# EAGLE design LoRaWio (EAGLE 6.3)
COMPANY: ADAFRUIT INDUSTRIES; DRAWN: KTOWN; REV: B
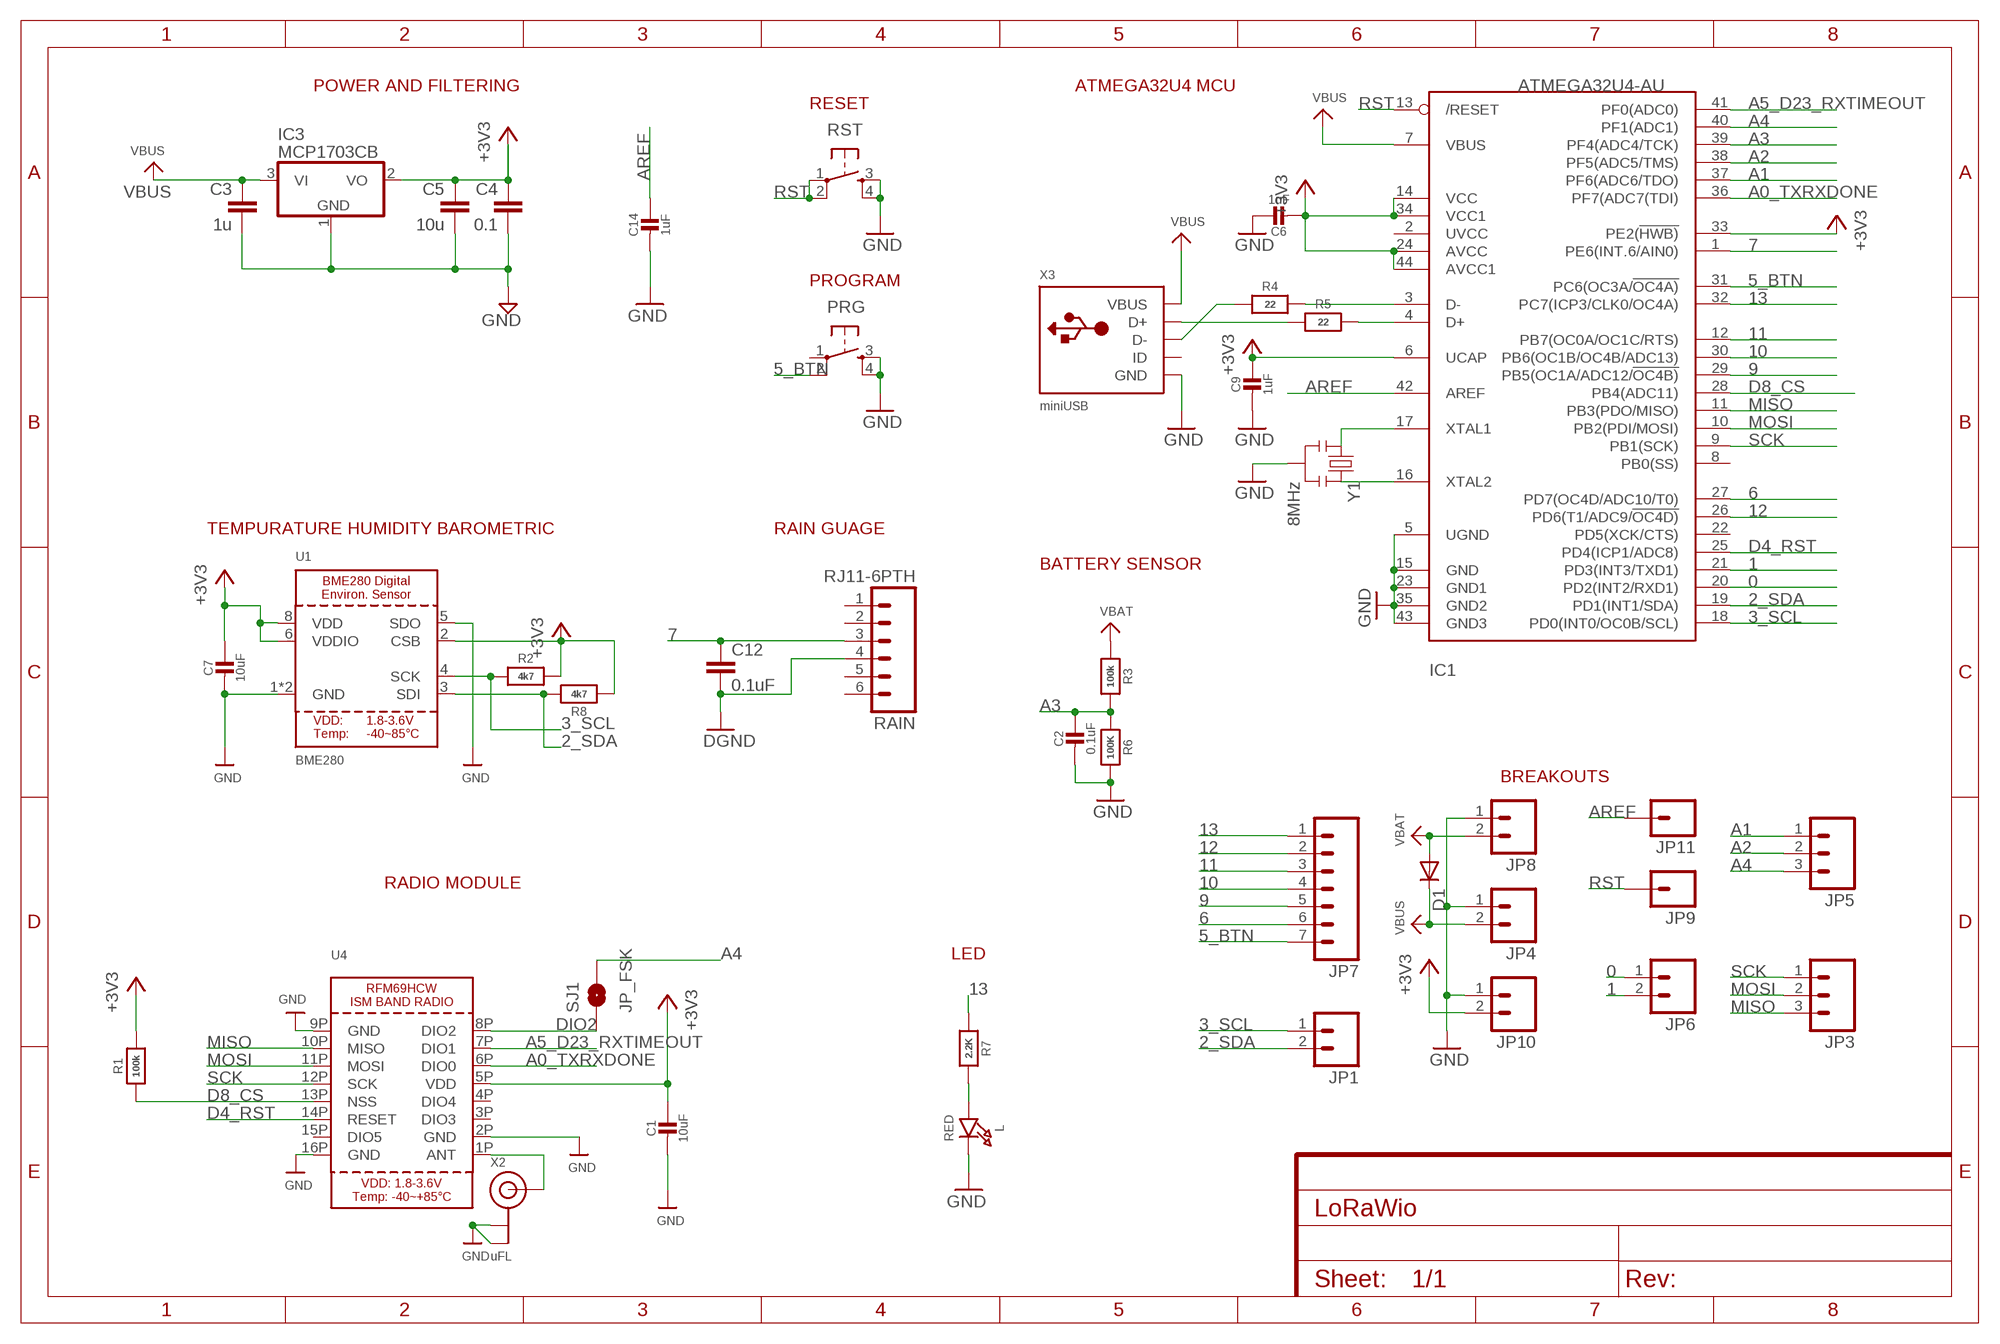
[diagram p0: schematic, sheet 1]

## Parts
C1  10uF  CAP_CERAMIC0805-NOOUTLINE  [0805-NO]
C2  0.1uF  CAP_CERAMIC0805-NOOUTLINE  [0805-NO]
C3  1u  CAP0805  [0805]
C4  0.1  CAP0805  [0805]
C5  10u  CAP0805-CAP  [0805-CAP]
C6  1uF  CAP_CERAMIC0805-NOOUTLINE  [0805-NO]
C7  10uF  CAP_CERAMIC0805-NOOUTLINE  [0805-NO]
C9  1uF  CAP_CERAMIC0805-NOOUTLINE  [0805-NO]
C12  0.1uF  CAP0805  [0805]
C14  1uF  CAP_CERAMIC0805-NOOUTLINE  [0805-NO]
D1  DIODESOD  [SOD-323]
IC1  ATMEGA32U4-AU  [TQFP44]
IC3  MCP1703CB  [SOT23]
JP1  M021X02_NO_SILK  [1X02_NO_SILK]
JP3  M031X03_NO_SILK  [1X03_NO_SILK]
JP4  M021X02_NO_SILK  [1X02_NO_SILK]
JP5  M031X03_NO_SILK  [1X03_NO_SILK]
JP6  M021X02_NO_SILK  [1X02_NO_SILK]
JP7  M07  [1X07]
JP8  M021X02_NO_SILK  [1X02_NO_SILK]
JP9  M01PTH_NO_SILK_YES_STOP  [1X01_NO_SILK]
JP10  M021X02_NO_SILK  [1X02_NO_SILK]
JP11  M01PTH_NO_SILK_YES_STOP  [1X01_NO_SILK]
L  RED  LED0805_NOOUTLINE  [CHIPLED_0805_NOOUTLINE]
PRG  TAC_SWITCHSMD  [TACTILE_SWITCH_SMD]
R1  100k  RESISTOR0805_NOOUTLINE  [0805-NO@1]
R2  4k7  RESISTOR0805_NOOUTLINE  [0805-NO@1]
R3  100k  RESISTOR0805_NOOUTLINE  [0805-NO@1]
R4  22  RESISTOR0805_NOOUTLINE  [0805-NO@1]
R5  22  RESISTOR0805_NOOUTLINE  [0805-NO@1]
R6  100K  RESISTOR0805_NOOUTLINE  [0805-NO@1]
R7  2.2K  RESISTOR0805_NOOUTLINE  [0805-NO@1]
R8  4k7  RESISTOR0805_NOOUTLINE  [0805-NO@1]
RAIN  RJ11-6PTH  [RJ11-6]
RST  TAC_SWITCHSMD  [TACTILE_SWITCH_SMD]
SJ1  JP_FSK  SPARKFUN-PASSIVES_SOLDERJUMPERNO  [SPARKFUN-PASSIVES_SJ_2S-NO]
U1  BME280  [BME280]
U4  RFM69HCW_SMT  [RFMHCW_SMT]
X2  uFL  ANTENNA_U.FL  [U.FL]
X3  miniUSB  USBMINIBLARGE  [USB-MINIB_LARGER]
Y1  8MHz  RESONATORSMD  [RESONATOR-SMD]

## Nets
0: IC1.20(PD2(INT2/RXD1)) JP6.1
1: IC1.21(PD3(INT3/TXD1)) JP6.2
2_SDA: IC1.19(PD1(INT1/SDA)) JP1.2 R8.2 U1.3(SDI)
3_SCL: IC1.18(PD0(INT0/OC0B/SCL)) JP1.1 R2.1 U1.4(SCK)
5_BTN: IC1.31(PC6(OC3A/!OC4A)) JP7.7 PRG.2
6: IC1.27(PD7(OC4D/ADC10/T0)) JP7.6
7: C12.1 IC1.1(PE6(INT.6/AIN0)) RAIN.3
9: IC1.29(PB5(OC1A/ADC12/!OC4B)) JP7.5
10: IC1.30(PB6(OC1B/OC4B/ADC13)) JP7.4
11: IC1.12(PB7(OC0A/OC1C/RTS)) JP7.3
12: IC1.26(PD6(T1/ADC9/!OC4D)) JP7.2
13: IC1.32(PC7(ICP3/CLK0/OC4A)) JP7.1 R7.1
+3V3: C1.1 C4.1 C5.1 C6.2 C7.1 C9.1 IC1.6(UCAP) IC1.14(VCC) IC1.24(AVCC) IC1.33(PE2(!HWB)) IC1.34(VCC1) IC1.44(AVCC1) IC3.2(VO) JP10.2 R1.2 R2.2 R8.1 U1.2(CSB) U1.6(VDDIO) U1.8(VDD) U4.5P(VDD)
A0_TXRXDONE: IC1.36(PF7(ADC7(TDI)) U4.6P(DIO0)
A1: IC1.37(PF6(ADC6/TDO)) JP5.1
A2: IC1.38(PF5(ADC5/TMS)) JP5.2
A3: C2.1 IC1.39(PF4(ADC4/TCK)) R3.2 R6.1
A4: IC1.40(PF1(ADC1)) JP5.3 SJ1.2
A5_D23_RXTIMEOUT: IC1.41(PF0(ADC0)) U4.7P(DIO1)
ANT: U4.1P(ANT) X2.3(SIGNAL)
AREF: C14.1 IC1.42(AREF) JP11.1
D4_RST: IC1.25(PD4(ICP1/ADC8)) U4.14P(RESET)
D8_CS: IC1.28(PB4(ADC11)) R1.1 U4.13P(NSS)
D+: IC1.4(D+) R5.2
D-: IC1.3(D-) R4.2
DIO2: SJ1.1 U4.8P(DIO2)
GND: C1.2 C2.2 C3.2 C4.2 C5.2 C6.1 C7.2 C9.2 C12.2 C14.2 IC1.5(UGND) IC1.15(GND) IC1.23(GND1) IC1.35(GND2) IC1.43(GND3) IC3.1(GND) JP4.1 JP8.1 JP10.1 L.C PRG.3 PRG.4 R6.2 RAIN.4 RST.3 RST.4 U1.1(GND) U1.5(SDO) U1.7(GND) U4.2P(GND) U4.9P(GND) U4.16P(GND) X2.1(GND) X2.2(GND) X3.GND X3.GND1(GND) X3.GND2(GND) X3.GND3(GND) X3.GND4(GND) Y1.2 ; supply symbol labelled DGND
MISO: IC1.11(PB3(PDO/MISO)) JP3.3 U4.10P(MISO)
MOSI: IC1.10(PB2(PDI/MOSI)) JP3.2 U4.11P(MOSI)
N$2: L.A R7.2
N$11: IC1.16(XTAL2) Y1.3
N$12: IC1.17(XTAL1) Y1.1
N$15: R5.1 X3.D+
N$16: R4.1 X3.D-
RST: IC1.13(/RESET) JP9.1 RST.1 RST.2
SCK: IC1.9(PB1(SCK)) JP3.1 U4.12P(SCK)
VBAT: D1.2(A) JP8.2 R3.1
VBUS: C3.1 D1.1(C) IC1.7(VBUS) IC3.3(VI) JP4.2 X3.VBUS
Unconnected: IC1.2(UVCC) IC1.8(PB0(SS)) IC1.22(PD5(XCK/CTS)) PRG.1 RAIN.1 RAIN.2 RAIN.5 RAIN.6 U4.3P(DIO3) U4.4P(DIO4) U4.15P(DIO5) X3.ID

## Notes on the sheet
- POWER AND FILTERING | ATMEGA32U4 MCU
- RESET
- PROGRAM
- TEMPURATURE HUMIDITY BAROMETRIC | RAIN GUAGE
- BATTERY SENSOR
- BREAKOUTS
- RADIO MODULE
- LED

## Library data of the parts
C1 C2 C6 C7 C9 C14 = microbuilder:CAP_CERAMIC: Ceramic Capacitors For new designs, use the packages preceded by an '_' character since they are more reliable: The following footprints should be used on most boards: _0402 - Standard footprint for regular board layouts _0603 - Standard footprint for regular board layouts _0805 - Standard footprint for regular board layouts _1206 - Standard footprint for regular board layouts For extremely tight-pitch boards where space is at a premium, the following 'micro-pitch' footprints can be used (smaller pads, no silkscreen outline, etc.): _0402MP - Micro-pitch footprint for very dense/compact boards _0603MP - Micro-pitch footprint for very dense/compact boards _0805MP - Micro-pitch footprint for very dense/compact boards _1206MP - Micro-pitch footprint for very dense/compact boards
C3-C5 = LowPowerLab:CAP: Capacitor Standard 0603 ceramic capacitor, and 0.1" leaded capacitor.
C12 = SparkFun-Capacitors:CAP: Capacitor Standard 0603 ceramic capacitor, and 0.1" leaded capacitor.
D1 = SparkFun-DiscreteSemi:DIODE: Diode These are standard reverse protection diodes and small signal diodes. SMA package can handle up to about 1A. SOD-323 can handle about 200mA. What the SOD-323 package when ordering, there are some mfgs out there that are 5-pin packages.
IC1 = microbuilder:ATMEGA32U4: http://www.ladyada.net/library/eagle
IC3 = linear:MCP1703: 250 mA, 16V, Low Quiescent Current LDO Regulator Source: http://ww1.microchip.com/downloads/en/DeviceDoc/22049b.pdf
JP1 JP4 JP6 JP8 JP10 = SparkFun-Connectors:M02: Standard 2-pin 0.1" header. Use with - straight break away headers ( PRT-00116) - right angle break away headers (PRT-00553) - swiss pins (PRT-00743) - machine pins (PRT-00117) - female headers (PRT-00115) Molex polarized connector foot print use with: PRT-08233 with associated crimp pins and housings. 2.54_SCREWTERM for use with PRT-10571. 3.5mm Screw Terminal footprints for PRT-08084 5mm Screw Terminal footprints for use with PRT-08432
JP3 JP5 = SparkFun-Connectors:M03: Header 3 Standard 3-pin 0.1" header. Use with straight break away headers (SKU : PRT-00116), right angle break away headers (PRT-00553), swiss pins (PRT-00743), machine pins (PRT-00117), and female headers (PRT-00115). Molex polarized connector foot print use with SKU : PRT-08232 with associated crimp pins and housings.
JP7 = SparkFun-Connectors:M07: Header 7 Standard 7-pin 0.1" header. Use with straight break away headers (SKU : PRT-00116), right angle break away headers (PRT-00553), swiss pins (PRT-00743), machine pins (PRT-00117), and female headers (PRT-00115). NOTES ON THE VARIANTS LOCK and LOCK_LONGPADS... This footprint was designed to help hold the alignment of a through-hole component (i.e. 7-pin header) while soldering it into place. You may notice that each hole has been shifted either up or down by 0.005 of an inch from it's more standard position (which is usually a perfectly straight line). This slight alteration caused the pins (the squares in the middle) to touch the edges of the holes. Because they are alternating, it causes a "brace" to hold the header in place. 0.005 has proven to be the perfect amount of "off-center" position when using our standard breakaway headers. Although looks a little odd when you look at the bare footprint, once you have a header in there, the alteration is very hard to notice. Also, if you push a header all the way into place, it is covered up entirely on the bottom side. This idea of altering the position of holes to aid alignment will be further integrated into the Sparkfun Library for other footprints. It can help hold any component with 3 or more connection pins.
JP9 JP11 = SparkFun-Connectors:M01: Header 1 Standard 1-pin 0.1" header. Use with straight break away headers (SKU : PRT-00116), right angle break away headers (PRT-00553), swiss pins (PRT-00743), machine pins (PRT-00117), and female headers (PRT-00115).
L = microbuilder:LED: LED 0603 - 0603 Surface Mount Package 2mA: Green LED - Low Power (3.9mcd, 2ma, 1.7Vf) - Digikey: 475-2709-2-ND Orange LED - Low Power (9.8mcd, 2ma, 1.8Vf) - Digikey: 475-1194-2-ND Red LED - Low Power (5mcd, 2ma, 1.8Vf) - Digikey: 475-1195-2-ND Yellow LED - Low Power (7mcd, 2ma, 1.8Vf) - Digikey: 475-1196-2-ND 5mA: Blue LED - Low Power (17mcd, 5ma, 2.9Vf) - Digikey: LNJ937W8CRACT-ND 0805 - 0805 Surface Mount Package 2mA: Red LED (8.8mcd, 2mA, 1.8Vf, Clear) - Low Power [Digikey: 475-2510-1-ND] Green LED (5mcd, 2mA, 1.8Vf, Clear) - Low Power [Digikey: 475-2730-1-ND] Yellow LED (11.3mcd, 2mA, 1.8Vf, Clear) - Low Power [Digikey: 475-2555-1-ND] 20mA: Red LED (104mcd, 20mA, Diffused) - LS R976 [Digikey: 475-1278-6-ND] Red LED (12mcd, 20mA, 2.0Vf, Clear) - APT2012EC [Digikey: 754-1128-1-ND] Green LED (15mcd, 20mA, 2.2Vf, Clear) - APT2012GC [Digikey: 754-1131-1-ND] Orange LED (160mcd, 20mA, 2.1Vf, Clear) - APT2012SECK [Digikey: 754-1130-1-ND] 1206 - 1206 Surface Mount Package Green LED (26mcd, 20mA, Diffused) - LG N971 [Digikey: 475-1407-6-ND] Red LED (15mcd, 20mA, Diffused) - LH N974 [Digikey: 475-1416-6-ND] Cree - Cree High-Power Surface Mount LEDs XPEBWT-L1-0000-00D50 - White 111lm 350mA 2.9Vf 6200K 110° XTEAWT-00-0000-00000LEE3 - White 114lm 350mA 2.85Vf 5000K 115° Everlight - Everlight 45-21 Series Surface Mount LEDs 45-21/QK2C-B2832AC2CB2/2T - Warm White 2000mcd 20mA 3.25Vf 3050K 120° 45-21/LK2C-B38452C4CB2/2T - Nuetral White 2000mcd 20mA 3.25Vf 4150K 120° 45-21/LK2C-B50634C6CB2/2T - Cold White 2200mcd 20mA 3.25Vf 5650K 120° PLCC2 Reverse Mount LS T77K-J1L2-1-0-2-R18-Z - Red 11.25mcd 2mA 1.8Vf 630nm 120° LO T77K-L1M2-24-Z - Orange 19.6mcd 2mA 1.8Vf 606nm 120° LY T77K-K2M1-26-Z - Yellow 15.7mcd 2mA 1.8Vf 587nm 120°
PRG RST = SparkFun-Electromechanical:TAC_SWITCH: Momentary Switch Button commonly used for reset or general input. Spark Fun Electronics SKU : COM-00097 SMT- SWCH-08247; PROD_ID: SWCH-08247
R1-R8 = microbuilder:RESISTOR: Resistors For new designs, use the packages preceded by an '_' character since they are more reliable: The following footprints should be used on most boards: _0402 - Standard footprint for regular board layouts _0603 - Standard footprint for regular board layouts _0805 - Standard footprint for regular board layouts _1206 - Standard footprint for regular board layouts For extremely tight-pitch boards where space is at a premium, the following 'micro-pitch' footprints can be used (smaller pads, no silkscreen outline, etc.): _0402MP - Micro-pitch footprint for very dense/compact boards _0603MP - Micro-pitch footprint for very dense/compact boards _0805MP - Micro-pitch footprint for very dense/compact boards _1206MP - Micro-pitch footprint for very dense/compact boards
RAIN = SparkFun-Connectors:RJ11-6: RJ11 Jack Simple 6 pin RJ11 jack. Commonly found on CAT3 devices and Microchip programmers. SKU: PRT-00132; PROD_ID: CONN-08590; VALUE: RJ11
SJ1 = tempLED_GARAGE_BOX:SPARKFUN-PASSIVES_SOLDERJUMPER: Solder Jumper Standard SMD solder jumper. Used to automate production. Two varients : Normally Open and Normally Closed are the same, but have different paste layers. NC will have a large amount of paste and should jumper during reflow.
U1 = microbuilder:BME280: BME280 - Environmental Sensor (I2C + SPI)
U4 = microbuilder:RFM69HCW: RFM69HCW - ISM Band RF Transceiver
X2 = microbuilder:ANTENNA_U.FL: U.FL Antenna Connector
X3 = microbuilder:USB: USB Connectors USBMINIB - Surface Mount Female Mini-B USB Connector 4UConnector: 06564
Y1 = SparkFun:RESONATOR: Resonator Small SMD resonator. This is the itty bitty 10/20MHz resonators with built in caps. CSTCE10M0G55 and CSTCE20M0V53. Footprint has been reviewed closely but hasn't been tested yet.

## Net classes
1 power: width 0.381 mm, clearance 0.254 mm

## Board
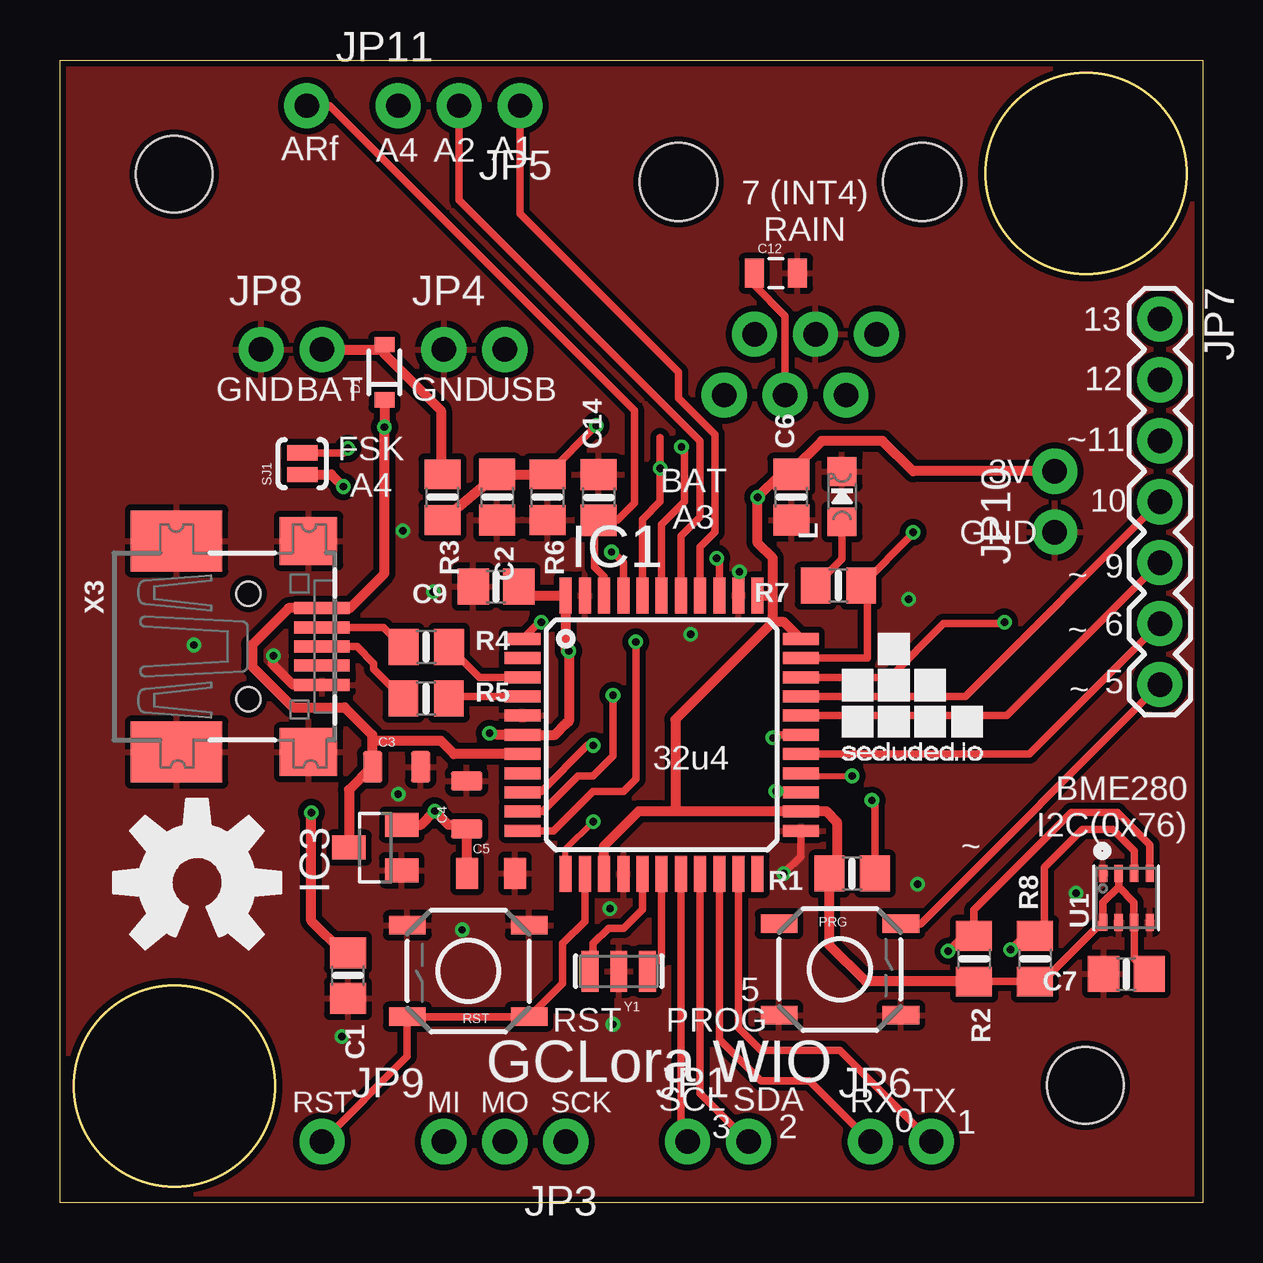
[diagram p1: board, top side]
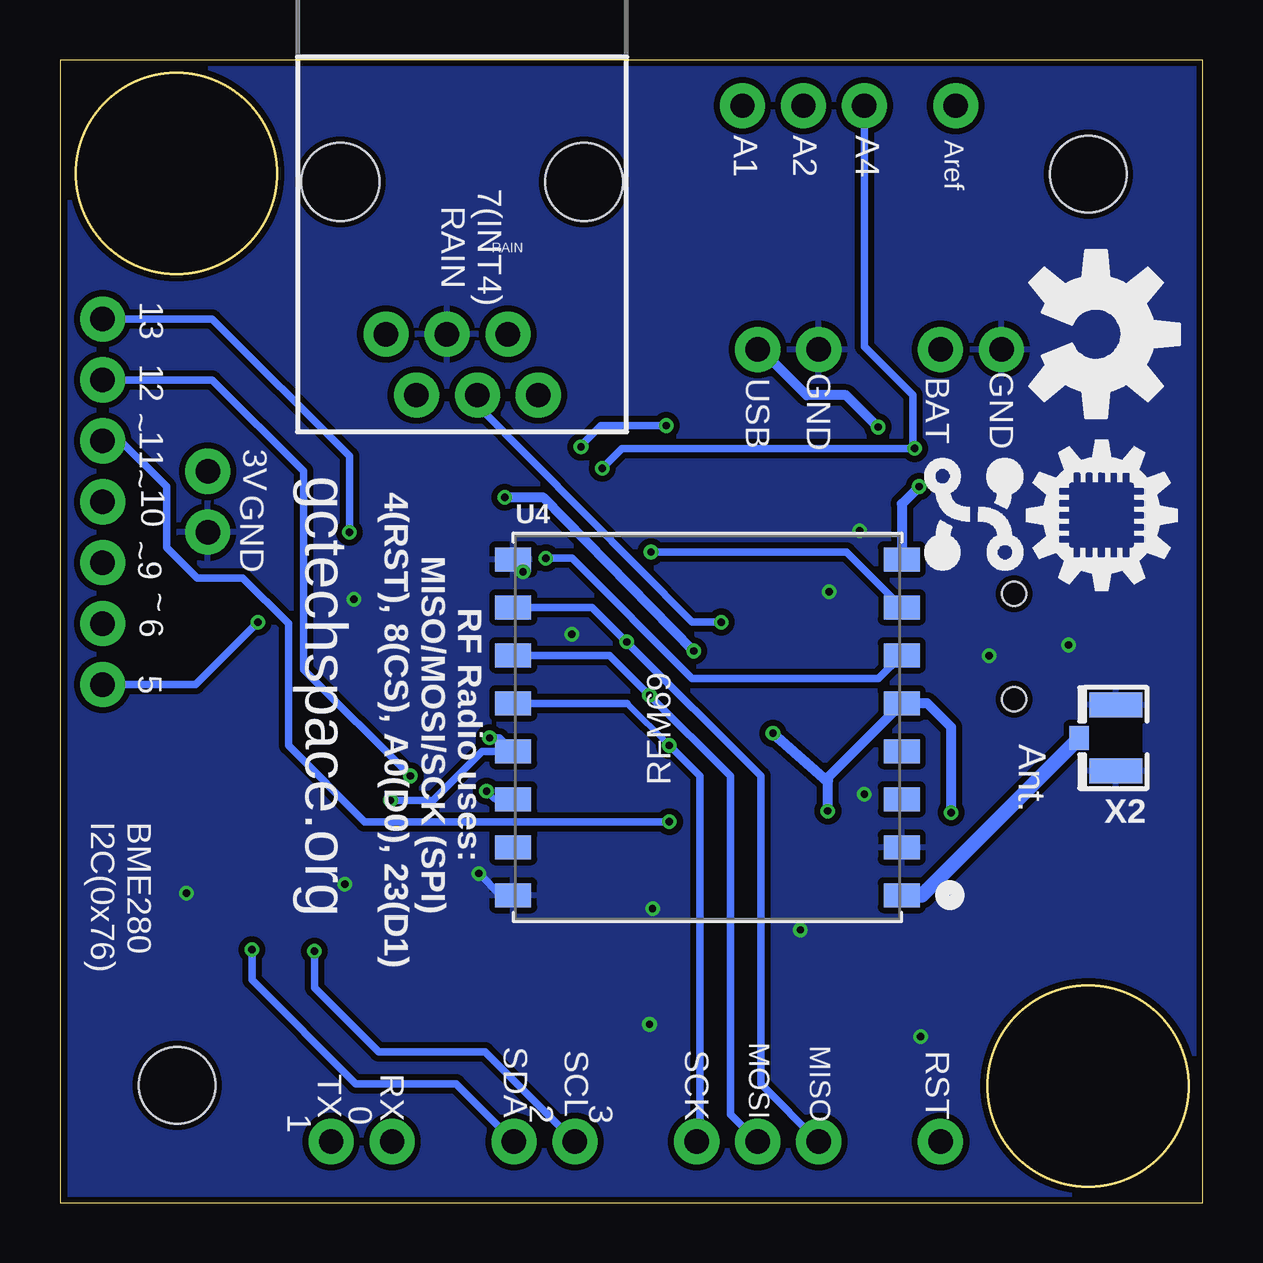
[diagram p2: board, bottom side, seen from below]

Size 47.62 x 47.62 mm. Coordinates in mm from the lower left corner, seen from the top.
Outline: 47.62,47.62 47.62,0 0,0 0,47.62 47.62,47.62
Outline: circle at 4.76,4.86 radius 4.19
Outline: circle at 42.77,42.89 radius 4.19
Copper layers (1*16): Top 0.035mm / dielectric 1.5mm / Bottom 0.035mm
Design rules "dirt_cheap_dirty_boards.v1": minimum track width 5mil, minimum drill 12mil, track to track 5mil, track to pad 5mil, pad to pad 5mil, via to via 5mil, smd to smd 0mil, copper to edge 10mil, drill to drill 10mil, minimum pad ring 10mil, minimum via ring 6mil, stop-mask expansion 2mil, vias tented up to drill 25mil, thermal gap 10mil
Holes 3.2 mm at 4.76,42.86 42.74,4.89
tRestrict: area 20.8,9.3 to 21.1,12.8; area 20.7,8.1 to 22.9,8.5; area 26.2,10.3 to 26.5,13.3

### Footprints (pad centres in the part's own frame; a part is rotated, then mirrored left to right if it is on the bottom)
0805-NO = smd 1.3 x 1.5: 1 -0.95,0; 2 0.95,0
0805 = smd 0.8 x 1.3: 1 -1,0; 2 1,0
0805-CAP = smd 0.902 x 1.3: 1 -1,0; 2 1,0
0805' = smd 0.8 x 1.2: 1 -0.9,0; 2 0.9,0
SOD-323 = smd 0.63 x 0.83: 1 -1.15,0; 2 1.15,0
TQFP44 = smd 1.5 x 0.5: 1 -5.8,4; 2 -5.8,3.2; 3 -5.8,2.4; 4 -5.8,1.6; 5 -5.8,0.8; 6 -5.8,0; 7 -5.8,-0.8; 8 -5.8,-1.6; 9 -5.8,-2.4; 10 -5.8,-3.2; 11 -5.8,-4; 23 5.8,-4; 24 5.8,-3.2; 25 5.8,-2.4; 26 5.8,-1.6; 27 5.8,-0.8; 28 5.8,0; 29 5.8,0.8; 30 5.8,1.6; 31 5.8,2.4; 32 5.8,3.2; 33 5.8,4 | smd 0.5 x 1.5: 12 -4,-5.8; 13 -3.2,-5.8; 14 -2.4,-5.8; 15 -1.6,-5.8; 16 -0.8,-5.8; 17 0,-5.8; 18 0.8,-5.8; 19 1.6,-5.8; 20 2.4,-5.8; 21 3.2,-5.8; 22 4,-5.8; 34 4,5.8; 35 3.2,5.8; 36 2.4,5.8; 37 1.6,5.8; 38 0.8,5.8; 39 0,5.8; 40 -0.8,5.8; 41 -1.6,5.8; 42 -2.4,5.8; 43 -3.2,5.8; 44 -4,5.8
SOT23 = smd 1 x 1.4: 1 -0.95,-1.1; 2 0.95,-1.1; 3 0,1.1
1X02_NO_SILK = drill 1.016 pad 1.88: 1 0,0; 2 2.54,0
1X03_NO_SILK = drill 1.016 pad 1.88: 1 0,0; 2 2.54,0; 3 5.08,0
1X07 = drill 1.016 pad 1.88: 1 0,0; 2 2.54,0; 3 5.08,0; 4 7.62,0; 5 10.16,0; 6 12.7,0; 7 15.24,0
1X01_NO_SILK = drill 1.016 pad 1.88: 1 0,0
CHIPLED_0805_NOOUTLINE = smd 1.2 x 1.2: A 0,-1.05; C 0,1.05
TACTILE_SWITCH_SMD = smd 1.524 x 0.762: 1 -2.54,1.905; 2 2.54,1.905; 3 -2.54,-1.905; 4 2.54,-1.905
0805-NO@1 = smd 1.24 x 1.5: 1 -0.95,0; 2 0.95,0
RJ11-6 = drill 1.016 pad 1.88: 1 -3.175,8.89; 2 -1.905,6.35; 3 -0.635,8.89; 4 0.635,6.35; 5 1.905,8.89; 6 3.175,6.35 | hole 3.251: -5.08,0; 5.08,0
SPARKFUN-PASSIVES_SJ_2S-NO = smd 0.635 x 1.27: 1 -0.45,0; 2 0.45,0
BME280 = smd 0.7 x 0.35: 1 1.025,0.975; 2 1.025,0.325; 3 1.025,-0.325; 4 1.025,-0.975; 5 -1.025,-0.975; 6 -1.025,-0.325; 7 -1.025,0.325; 8 -1.025,0.975
RFMHCW_SMT = smd 1.5 x 1: 1P 8.1,-7; 2P 8.1,-5; 3P 8.1,-3; 4P 8.1,-1; 5P 8.1,1; 6P 8.1,3; 7P 8.1,5; 8P 8.1,7; 9P -8.1,7; 10P -8.1,5; 11P -8.1,3; 12P -8.1,1; 13P -8.1,-1; 14P -8.1,-3; 15P -8.1,-5; 16P -8.1,-7
U.FL = smd 2.2 x 1.05: 1 0,1.375; 2 0,-1.375 | smd 0.8 x 1: 3 1.525,0
USB-MINIB_LARGER = smd 0.5 x 2.308: D+ 0,4.064; D- -0.8,4.064; GND 1.6,4.064; ID 0.8,4.064; VBUS -1.6,4.064 | smd 2.54 x 3.81: GND1 -4.4,-2; GND4 4.4,-2 | smd 2 x 2.4: GND2 -4.4,3.5; GND3 4.4,3.5 | hole 1: -2.2,1; 2.2,1
RESONATOR-SMD = smd 0.7 x 1.7: 1 -1.2,0; 2 0,0; 3 1.2,0

### Placement (x,y rotation side)
C1  12,9.46 270 top
C2  18.22,29.4 270 top
C3  14.03,18.16 0 top
C4  16.95,16.57 90 top
C5  17.97,13.72 0 top
C6  30.48,29.4 90 top
C7  44.45,9.53 180 top
C9  18.18,25.67 180 top
C12  0.1uF  [0805']  29.84,38.73 0 top
C14  22.45,29.39 90 top
D1  13.53,34.61 90 top
IC1  25.08,19.49 0 top
IC3  13.14,14.8 90 top
JP1  26.16,2.54 0 top
JP3  21.08,2.54 180 top
JP4  16,35.56 0 top
JP5  19.18,45.72 180 top
JP6  33.78,2.54 0 top
JP7  45.85,36.83 270 top
JP8  8.38,35.56 0 top
JP9  10.92,2.54 0 top
JP10  41.47,27.94 90 top
JP11  10.29,45.72 0 top
L  32.6,29.42 0 top
PRG  32.51,9.72 0 top
R1  33.02,13.72 180 top
R2  38.1,10.16 270 top
R3  15.94,29.4 270 top
R4  15.27,23.16 0 top
R5  15.26,21.01 0 top
R6  20.32,29.4 270 top
R7  32.45,25.72 180 top
R8  40.64,10.16 90 top
RAIN  30.86,42.55 180 bottom
RST  17.02,9.65 180 top
SJ1  10.1,30.8 90 top
U1  44.45,12.7 90 top
U4  20.64,19.81 0 bottom
U$5  [OSHW-LOGO-L]  5.71,13.34 0 top
U$6  [ESPDUINO_LOGO_5MM]  9.56,28.7 270 bottom
U$7  [SECLUDED_5MM]  32.51,18.32 0 top
U$15  [ID_LOGO_X0.25]  7.43,25.37 0 bottom
U$16  [OSHW-LOGO-L]  4.45,36.2 270 bottom
X2  3.62,19.37 180 bottom
X3  6.86,23.18 270 top
Y1  23.29,9.64 180 top

### Tracks (layer width: path | path; a pad name or v marks a point on that pad's centre or on a via)
0
  Top 0.305: IC1.20 27.48,6.81 29.21,5.08 31.24,5.08 JP6.1
1
  Top 0.305: IC1.21 28.28,7.28 29.21,6.35 32.51,6.35 JP6.2
2_SDA  (via drill 0.3)
  Top 0.305: IC1.19 26.68,4.56 JP1.2 | U1.3 44.77,14.66 43.88,15.56 42.61,15.56 41.02,13.97 41.02,11.49 R8.2 40.19,11.11 v39.62,10.54
  Bottom 0.305: v39.62,10.54 39.62,9.27 35.31,4.95 31.11,4.95 JP1.2
3_SCL  (via drill 0.3)
  Top 0.305: IC1.18 25.88,2.82 JP1.1 | U1.4 45.42,14.9 44.07,16.26 42.16,16.26 38.1,12.19 R2.1 37.65,11.11 v37.02,10.48
  Bottom 0.305: v37.02,10.48 37.02,8.95 34.35,6.29 29.91,6.29 JP1.1
5_BTN  (via drill 0.3)
  Top 0.305: v39.37,24.19 39.31,24.13 36.83,24.13 34.59,21.89 IC1.31 | PRG.2 35.88,11.62 JP7.7
  Bottom 0.305: JP7.7 41.97,21.59 v39.37,24.19
6
  Top 0.305: IC1.27 40.41,18.7 JP7.6
7  (via drill 0.3)
  Top 0.305: IC1.1 19.98,24.19 v20.07,24.19 | C12.1 28.95,38.24 30.23,36.96 RAIN.3
  Bottom 0.305: v20.07,24.19 21.27,24.19 30.23,33.21 RAIN.3
9
  Top 0.305: IC1.29 39.47,20.29 JP7.5
10
  Top 0.305: IC1.30 37.73,21.09 JP7.4
11  (via drill 0.3)
  Top 0.254: IC1.12 21.08,14.73 v22.23,15.88
  Bottom 0.305: v22.23,15.88 34.92,15.88 38.1,19.05 38.1,24.13 40.01,26.04 41.91,26.04 43.18,27.3 43.18,29.84 45.09,31.75 JP7.3
12  (via drill 0.3)
  Top 0.254: IC1.26 31,17.78 v33.02,17.78
  Bottom 0.305: v33.02,17.78 37.47,22.23 37.47,30.48 41.27,34.29 JP7.2
13  (via drill 0.3)
  Top 0.305: IC1.32 33.66,22.7 33.66,25.46 R7.1 35.56,27.88 v35.56,27.94
  Bottom 0.305: v35.56,27.94 35.56,31.11 41.27,36.83 JP7.1
+3V3  (via drill 0.3)
  Top 0.305: U1.2 44.12,13.15 | 44.12,13.15 44.77,12.51 44.77,11.68 U1.6 44.77,10.15 C7.1 | 44.12,13.15 43.48,12.5 U1.8 43.42,11.68 41.27,9.53 40.95,9.53 R8.1 R2.2
  Top 0.406: v17.91,19.56 18.22,19.49 IC1.6 20.64,19.49 21.08,19.94 21.21,20.07 v21.21,22.99 21.08,22.99 IC1.44 19.5,25.29 C9.1 | IC1.14 22.68,14.87 24.13,16.32 25.65,16.32 | 25.65,16.32 30.86,16.32 IC1.24 30.91,16.32 31.94,16.32 32.38,15.88 32.38,14.03 R1.2 32.07,10.73 33.59,9.21 R2.2 | 29.72,24.19 25.65,20.13 25.65,16.32 | IC1.33 30.18,24.19 29.72,24.19 | JP10.2 41.34,30.35 41.21,30.48 35.56,30.48 34.29,31.75 31.75,31.75 30.48,30.48 C6.2 30.03,30.35 v29.08,29.4 29.08,27.5 29.72,26.86 29.72,25.4 | 29.72,24.19 29.72,25.4 | IC1.34 29.61,25.29 29.72,25.4 | C5.1 16.95,13.73 C4.1 16.78,15.74 16.2,15.74 v15.62,16.32 15.05,15.74 IC3.2 | C1.1 11.81,10.41 10.48,11.75 v10.48,16.26
  Bottom 0.406: v29.08,29.4 27.49,29.4 v21.21,22.99 | v15.62,16.32 15.62,17.53 | 15.62,17.53 v17.91,19.56 | v10.48,16.26 10.48,19.81 11.48,20.81 U4.5P 15.62,17.73 15.62,17.53
A0_TXRXDONE  (via drill 0.3)
  Top 0.305: IC1.36 27.48,26.75 v27.37,26.86
  Bottom 0.305: v27.37,26.86 26.29,26.86 21.27,21.84 13.51,21.84 U4.6P
A1
  Top 0.305: IC1.37 26.68,27.32 27.3,27.94 27.3,32 25.78,33.53 25.78,34.61 19.18,41.21 JP5.1
A2
  Top 0.305: IC1.38 25.88,27.79 26.67,28.57 26.67,31.75 16.64,41.78 JP5.2
A3  (via drill 0.3)
  Top 0.305: R6.1 v22.35,32.38 | IC1.39 25.08,28.26 26.04,29.21 26.04,31.37 v25.91,31.5
  Top 0.406: R3.2 C2.1 R6.1
  Bottom 0.305: v22.35,32.38 25.08,32.38 25.91,31.56 v25.91,31.5
A4  (via drill 0.3)
  Top 0.305: SJ1.2 11.82,31.25 v12,31.43 | IC1.40 24.28,28.47 25.02,29.21 v25.02,30.61 25.02,31.88
  Bottom 0.305: v25.02,30.61 24.19,31.43 v12,31.43 12.06,31.5 12.06,33.66 14.1,35.69 JP5.3
A5_D23_RXTIMEOUT  (via drill 0.3)
  Top 0.305: IC1.41 23.48,26.68 23.05,27.11 v22.99,27.11
  Bottom 0.305: v22.99,27.11 14.84,27.11 U4.7P
ANT
  Bottom 0.61: U4.1P 11.7,12.81 X2.3
AREF
  Top 0.305: IC1.42 22.67,25.31 22.67,26.1 22.29,26.48 22.29,28 22.45,28.36 C14.1 23.23,28.44 23.94,29.15 23.94,33.02 11.24,45.72 JP11.1
D4_RST  (via drill 0.3)
  Top 0.254: IC1.25 30.83,17.14 v29.84,17.14
  Bottom 0.254: v29.84,17.14 29.51,16.81 U4.14P
D8_CS  (via drill 0.3)
  Top 0.305: R1.1 33.97,16.64 v33.85,16.76 | IC1.28 29.84,19.49 v29.72,19.37
  Bottom 0.305: v33.85,16.76 32.07,16.76 30.04,18.8 28.75,18.8 U4.13P 29.29,19.37 v29.72,19.37
D+
  Top 0.305: IC1.4 16.55,21.09 R5.2
D-
  Top 0.305: IC1.3 17.48,21.89 R4.2
DIO2  (via drill 0.3)
  Top 0.406: SJ1.1 11.31,30.35 v11.81,29.84
  Bottom 0.406: v11.81,29.84 12.54,29.12 U4.8P
GND  (via drill 0.3)
  Top 0.305: IC1.23 30.88,14.44 v30.16,13.72 | IC1.35 28.28,26.19 v28.32,26.29
  Top 0.406: X3.GND 9.73,21.58 8.89,22.42 v8.89,22.8
  Bottom 0.305: v30.16,13.72 29.26,12.81 U4.16P | v28.32,26.29 28.38,26.46 U4.9P
  other vias: 14.29,28 22.92,12.26 23.05,7.43 5.59,23.24 11.75,6.92 35.37,25.15 35.75,13.27 15.56,25.46 26.29,23.69 14.1,17.02 16.76,11.37 42.35,12.89
  pour Top (isolate 0.254): 0,47.62 0,0 47.18,0.06 47.18,47.62
  pour Bottom (isolate 0.254): 0,0 47.18,0.06 47.18,47.62 0,47.62
MISO  (via drill 0.3)
  Top 0.305: v24,23.37 24,17.65 23.5,17.14 22.23,17.14 20.57,15.49 IC1.11
  Bottom 0.305: U4.10P 25.45,24.81 v24,23.37 18.41,17.78 18.41,4.95 JP3.3
MOSI  (via drill 0.3)
  Top 0.305: v23.05,21.14 23.05,18.61 22.23,17.78 21.59,17.78 20.11,16.29 IC1.10
  Bottom 0.305: U4.11P 24.72,22.81 v23.05,21.14 19.68,17.78 19.68,3.68 JP3.2
N$2
  Top 0.305: R7.2 32.6,26.82 L.A
N$11
  Top 0.254: 22.23,9.77 Y1.3
  Top 0.305: IC1.16 24.28,12.22 23.5,11.43 22.86,11.43 22.23,10.79 22.23,9.77
N$12
  Top 0.305: IC1.17 25.08,10.23 Y1.1
N$15
  Top 0.305: X3.D+ 12.38,23.18 13.08,22.48 13.08,22.24 R5.1
N$16
  Top 0.305: X3.D- 13.5,23.98 R4.1
RST
  Top 0.305: IC1.13 21.88,11.72 20.95,10.79 20.95,9.14 RST.1 RST.2 14.48,6.1 JP9.1
SCK  (via drill 0.3)
  Top 0.254: 19.33,17.14 IC1.9
  Top 0.305: 19.33,17.14 20.07,17.14 21.97,19.05 v22.23,19.05
  Bottom 0.254: 20.95,2.67 JP3.1 | 23.99,20.81 v22.23,19.05
  Bottom 0.305: U4.12P 23.99,20.81 | 20.95,2.67 20.95,17.78 v22.23,19.05
VBAT
  Top 0.406: JP8.2 13.33,35.56 D1.2 13.53,35.37 15.88,33.02 15.88,30.41 R3.1
VBUS  (via drill 0.3)
  Top 0.406: 13.02,19.3 13.02,19.49 11.87,20.64 9.72,20.64 8,22.35 8,23.24 9.53,24.77 9.53,24.78 X3.VBUS 10.93,24.77 12.06,24.77 13.53,26.23 v13.53,32.32 D1.1 | 13.02,19.3 13.02,18.18 | 13.02,18.18 C3.1 | 13.02,18.18 12.04,17.2 IC3.3 | IC1.7 16.42,18.7 15.88,19.24 13.08,19.24 13.02,19.3
  Bottom 0.406: v13.53,32.32 14.86,33.66 16.51,33.66 18.41,35.56 JP4.2

### Text on the board
tPlace: ARf | A4 | A2 | A1 | 7 (INT4) / RAIN | 13 | GND | BAT | GND | USB | 12 | ~11 | FSK / A4 | 3V | BAT / A3 | 10 | GND | 9 | ~ | ~ | 6 | 5 | ~ | 32u4 | BME280 / I2C(0x76) | ~ | 5 | RST | PROG | GCLora WIO | RST | MI | MO | SCK | SCL | SDA | RX | TX | 3 | 2 | 0 | 1
bPlace: A4 | A2 | A1 | Aref | 7(INT4) / RAIN | 13 | 12 | GND | BAT | GND | USB | ~ | 3V | 11 | gctechspace.org | ~ | 10 | GND | ~ | 9 | ~ | 6 | 5 | RFM69 | Ant. | RF Radio uses: / MISO/MOSI/SCK (SPI) / 4(RST), 8(CS), A0(D0), 23(D1) | BME280 / I2C(0x76) | RST | MISO | MOSI | SCK | SCL | SDA | 3 | 2 | RX | 0 | TX | 1